# Altium schematic sheet BSU_Base.SchDoc: Battery Sampling Unit Base Board
size A4; DrawnBy: EEE Patrick; Organization: PERT; Revision: A; SheetNumber: 1; SheetTotal: 3; Version: 1.0; Sub Team: EEE; Module: BMS; Generation: NA
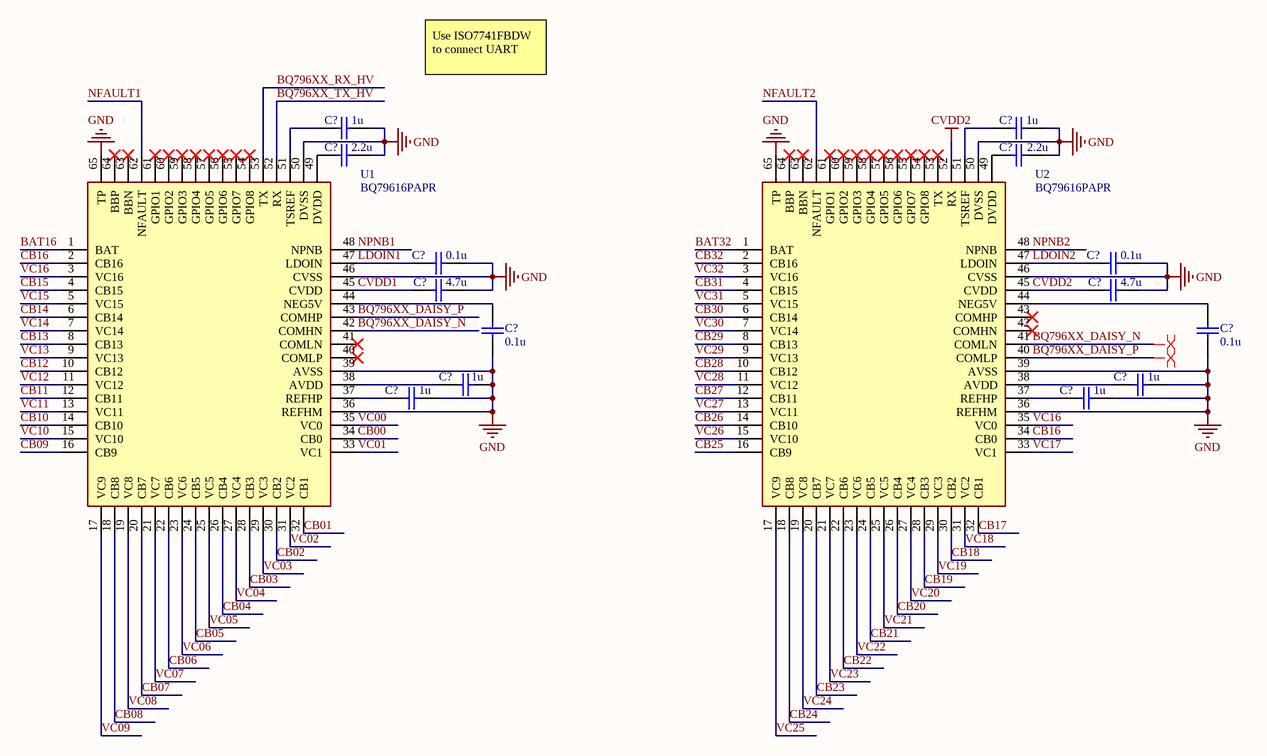
[diagram p0: BSU_Base.SchDoc]

## Parts
(Parts that share a designator on the sheet are numbered #1, #2 ... from top to bottom, then left to right.)
C?#1  1u  [0805_SMD_C]
C?#2  1u  [0805_SMD_C]
C?#3  2.2u  [0805_SMD_C]
C?#4  2.2u  [0805_SMD_C]
C?#5  0.1u  [0805_SMD_C]
C?#6  0.1u  [0805_SMD_C]
C?#7  4.7u  [0805_SMD_C]
C?#8  4.7u  [0805_SMD_C]
C?#9  0.1u  [0805_SMD_C]
C?#10  0.1u  [0805_SMD_C]
C?#11  1u  [0805_SMD_C]
C?#12  1u  [0805_SMD_C]
C?#13  1u  [0805_SMD_C]
C?#14  1u  [0805_SMD_C]
U1  BQ79616PAPR  [HTQFP65_BQ79616]
U2  BQ79616PAPR  [HTQFP65_BQ79616]

## Nets
CVDD2: C?#8.1 U2.45(CVDD) U2.52(RX)
GND: C?#1.2 C?#2.2 C?#3.2 C?#4.2 C?#5.1 C?#6.1 C?#7.2 C?#8.2 C?#9.1 C?#10.1 C?#11.1 C?#12.1 C?#13.1 C?#14.1 U1.36(REFHM) U1.39(AVSS) U1.46(CVSS) U1.50(DVSS) U1.65(TP) U2.36(REFHM) U2.39(AVSS) U2.46(CVSS) U2.50(DVSS) U2.65(TP)
BAT16: U1.1(BAT)
BAT32: U2.1(BAT)
BQ796XX_DAISY_N: U1.42(COMHN) U2.41(COMLN)
BQ796XX_DAISY_P: U1.43(COMHP) U2.40(COMLP)
BQ796XX_RX_HV: U1.53(TX)
BQ796XX_TX_HV: U1.52(RX)
CB00: U1.34(CB0)
CB01: U1.32(CB1)
CB02: U1.30(CB2)
CB03: U1.28(CB3)
CB04: U1.26(CB4)
CB05: U1.24(CB5)
CB06: U1.22(CB6)
CB07: U1.20(CB7)
CB08: U1.18(CB8)
CB09: U1.16(CB9)
CB10: U1.14(CB10)
CB11: U1.12(CB11)
CB12: U1.10(CB12)
CB13: U1.8(CB13)
CB14: U1.6(CB14)
CB15: U1.4(CB15)
CB16: U1.2(CB16) U2.34(CB0)
CB17: U2.32(CB1)
CB18: U2.30(CB2)
CB19: U2.28(CB3)
CB20: U2.26(CB4)
CB21: U2.24(CB5)
CB22: U2.22(CB6)
CB23: U2.20(CB7)
CB24: U2.18(CB8)
CB25: U2.16(CB9)
CB26: U2.14(CB10)
CB27: U2.12(CB11)
CB28: U2.10(CB12)
CB29: U2.8(CB13)
CB30: U2.6(CB14)
CB31: U2.4(CB15)
CB32: U2.2(CB16)
CVDD1: C?#7.1 U1.45(CVDD)
LDOIN1: C?#5.2 U1.47(LDOIN)
LDOIN2: C?#6.2 U2.47(LDOIN)
NFAULT1: U1.62(NFAULT)
NFAULT2: U2.62(NFAULT)
NPNB1: U1.48(NPNB)
NPNB2: U2.48(NPNB)
VC00: U1.35(VC0)
VC01: U1.33(VC1)
VC02: U1.31(VC2)
VC03: U1.29(VC3)
VC04: U1.27(VC4)
VC05: U1.25(VC5)
VC06: U1.23(VC6)
VC07: U1.21(VC7)
VC08: U1.19(VC8)
VC09: U1.17(VC9)
VC10: U1.15(VC10)
VC11: U1.13(VC11)
VC12: U1.11(VC12)
VC13: U1.9(VC13)
VC14: U1.7(VC14)
VC15: U1.5(VC15)
VC16: U1.3(VC16) U2.35(VC0)
VC17: U2.33(VC1)
VC18: U2.31(VC2)
VC19: U2.29(VC3)
VC20: U2.27(VC4)
VC21: U2.25(VC5)
VC22: U2.23(VC6)
VC23: U2.21(VC7)
VC24: U2.19(VC8)
VC25: U2.17(VC9)
VC26: U2.15(VC10)
VC27: U2.13(VC11)
VC28: U2.11(VC12)
VC29: U2.9(VC13)
VC30: U2.7(VC14)
VC31: U2.5(VC15)
VC32: U2.3(VC16)
NetC?#1_1: C?#1.1 U1.51(TSREF)
NetC?#2_1: C?#2.1 U2.51(TSREF)
NetC?#3_1: C?#3.1 U1.49(DVDD)
NetC?#4_1: C?#4.1 U2.49(DVDD)
NetC?#9_2: C?#9.2 U1.44(NEG5V)
NetC?#10_2: C?#10.2 U2.44(NEG5V)
NetC?#11_2: C?#11.2 U1.38(AVDD)
NetC?#12_2: C?#12.2 U2.38(AVDD)
NetC?#13_2: C?#13.2 U1.37(REFHP)
NetC?#14_2: C?#14.2 U2.37(REFHP)

Not connected (* = marked no-connect by the designer): U1 40(COMLP)* 41(COMLN)* 54(GPIO8)* 55(GPIO7)* 56(GPIO6)* 57(GPIO5)* 58(GPIO4)* 59(GPIO3)* 60(GPIO2)* 61(GPIO1)* 63(BBN)* 64(BBP)*; U2 42(COMHN)* 43(COMHP)* 53(TX)* 54(GPIO8)* 55(GPIO7)* 56(GPIO6)* 57(GPIO5)* 58(GPIO4)* 59(GPIO3)* 60(GPIO2)* 61(GPIO1)* 63(BBN)* 64(BBP)*

## Layout directives
differential pair: BQ796XX_DAISY_N, BQ796XX_DAISY_P

## Notes on the sheet
- Use ISO7741FBDW to connect UART
- Title
- Generation
- Organization
- Sub Team
- Module
- Ver.
- Rev.
- Date
- Drawn By

## Library data of the parts
C?#1-C?#14 = 0805_SMD_Capacitor: 0805 SMD Capacitor; Voltage Rating: *; Tolerance: *; Dielectric: *
  C?#1 C?#2 C?#11-C?#14: Value: 1u
  C?#3 C?#4: Value: 2.2u
  C?#5 C?#6 C?#9 C?#10: Value: 0.1u
  C?#7 C?#8: Value: 4.7u
U1 U2 = BQ79616PAPR: Battery Management 16-S precision battery monitor, balancer and integrated protector with stacking interface; Manufacturer_Name: Texas Instruments; Geometry.Height: 1.2mm; Mouser Part Number: 595-BQ79616PAPR; Mouser Price/Stock: https://www.mouser.co.uk/ProductDetail/Texas-Instruments/BQ79616PAPR?qs=1Kr7Jg1SGW8FUVDCFv5r0A%3D%3D; Manufacturer_Part_Number: BQ79616PAPR; Datasheet Link: https://www.ti.com/lit/ds/symlink/bq79616.pdf?ts=1694396292843&ref_url=https%253A%252F%252Fwww.ti.com%252Fproduct%252Fzh-tw%252FBQ79616